# EasyEDA schematic SCH_OnBoard_2023-06-21.json
TITLE: Sheet_1; REV: 1.0; Date: 2023-06-21; Sheet: 1/1; Drawn By: Yutaro Urata2; Company: Your Company
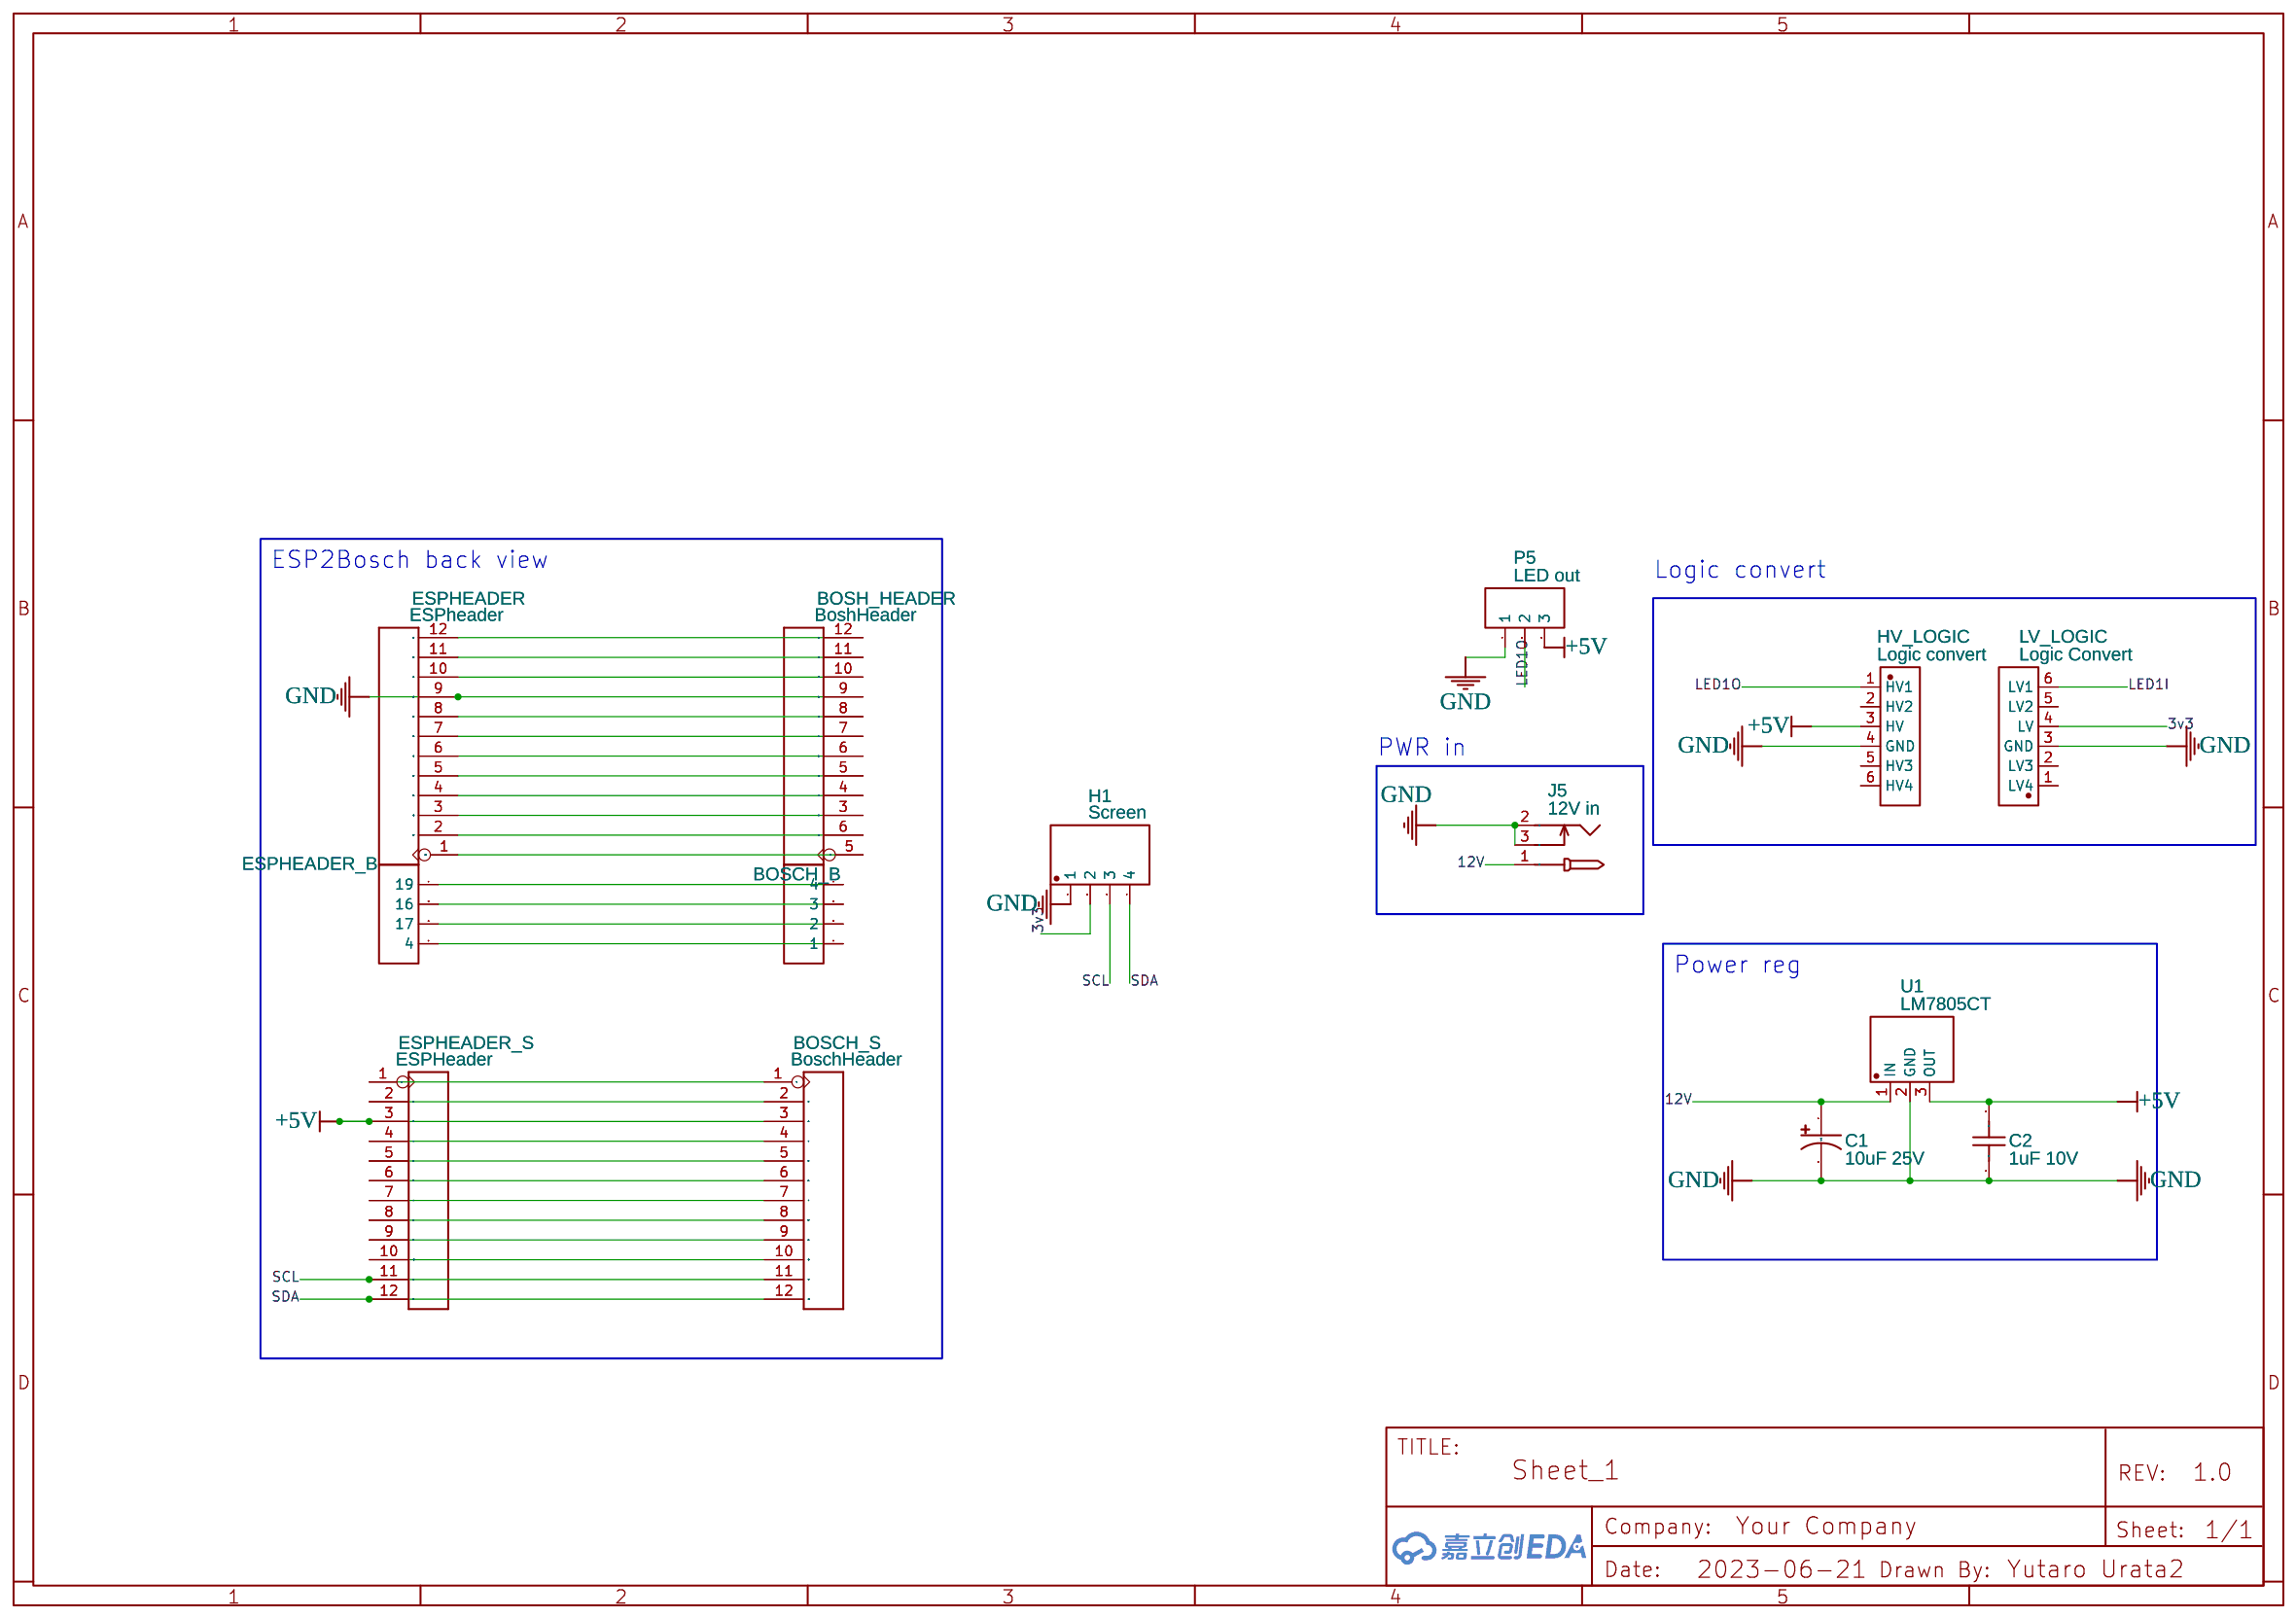
[diagram p0: schematic sheet]

## Parts
BOSCH_B  Header-Female-2.54_1x4  [HDR-4X1/2.54]
BOSCH_S  BoschHeader  [H12-2.54]
BOSH_HEADER  BoshHeader  [H12-2.54]
C1  10uF 25V  [CAP-SMD_L3.5-W2.8-R-RD]
C2  1uF 10V  [C0402]
ESPHEADER  ESPheader  [H12-2.54]
ESPHEADER_B  Header-Female-2.54_1x4  [HDR-4X1/2.54]
ESPHEADER_S  ESPHeader  [H12-2.54]
H1  Screen  [HDR-TH_4P-P2.54-V-M]
HV_LOGIC  Logic convert  [HDR-TH_6P-P2.54-V-F]
J5  12V in  [DC-IN-TH_DC-005C-20A]
LV_LOGIC  Logic Convert  [HDR-TH_6P-P2.54-V-F]
P5  LED out  [HDR-TH_3P-P2.54-V-F]
U1  LM7805CT  [TO-220-3_L10.0-W4.5-P2.54-L]

## Library data of the parts
BOSCH_B ESPHEADER_B = Header-Female-2.54_1x4: Supplier: LCSC; Manufacturer: ReliaPro; Supplier Part: C124413
BOSCH_S BOSH_HEADER ESPHEADER ESPHEADER_S = HEADER-12P-2.54
C1 = CA45A-B-25V-10UF-K: Supplier: LCSC; Supplier Part: C161582; Manufacturer: CEC(振华新云); Manufacturer Part: CA45A-B-25V-10uF-K; Contributor: LCSC; JLCPCB Part Class: Extended Part
C2 = GRM155R61A105KE01D: Supplier: LCSC; Manufacturer: null; Supplier Part: C76998; JLCPCB Part Class: Extended Part
H1 = Header-Male-2.54_1x4: Supplier: LCSC; Manufacturer: Ckmtw(灿科盟); Manufacturer Part: B-2100S04P-A110; Contributor: LCSC; Supplier Part: C124378; JLCPCB Part Class: Extended Part
HV_LOGIC LV_LOGIC = Header-Female-2.54_1x6: Supplier: LCSC; Manufacturer: BOOMELE(博穆精密); Manufacturer Part: 2.54-1*6P母; Supplier Part: C40877; JLCPCB Part Class: Extended Part
J5 = DC-005C-20A: Supplier: LCSC; Manufacturer: 韩国韩荣; Supplier Part: C84007; JLCPCB Part Class: Extended Part
P5 = Header-Female-2.54_1x3: Supplier Part: C146243; Supplier: LCSC; Manufacturer: BOOMELE(博穆精密); Manufacturer Part: 2.54-1*3P母; link: https://datasheet.lcsc.com/szlcsc/Boom-Precision-Elec-2-54mm-1-8P-Straight-Female-header_C27438.pdf; JLCPCB Part Class: Extended Part
U1 = LM7805CT: Supplier: LCSC; Manufacturer: onsemi(安森美); Supplier Part: C22146; JLCPCB Part Class: Extended Part

## Nets
3v3: H1.2 LV_LOGIC.4(LV)
12V: C1.1 J5.1 U1.1(IN)
+5V: BOSCH_S.3 C2.2 ESPHEADER_S.3 HV_LOGIC.3(HV) P5.3 U1.3(OUT)
GND: BOSH_HEADER.9 C1.2 C2.1 ESPHEADER.9(GND) H1.1 HV_LOGIC.4(GND) J5.2 J5.3 LV_LOGIC.3(GND) P5.1 U1.2(GND)
LED1I: LV_LOGIC.6(LV1)
LED1O: HV_LOGIC.1(HV1) P5.2
SCL: BOSCH_S.11 ESPHEADER_S.11 H1.3
SDA: BOSCH_S.12 ESPHEADER_S.12 H1.4
Net-(BOSCH_B-1): BOSCH_B.1 ESPHEADER_B.1(4)
Net-(BOSCH_B-2): BOSCH_B.2 ESPHEADER_B.2(17)
Net-(BOSCH_B-3): BOSCH_B.3 ESPHEADER_B.3(16)
Net-(BOSCH_B-4): BOSCH_B.4 ESPHEADER_B.4(19)
Net-(BOSCH_S-1): BOSCH_S.1 ESPHEADER_S.1
Net-(BOSCH_S-2): BOSCH_S.2 ESPHEADER_S.2
Net-(BOSCH_S-4): BOSCH_S.4 ESPHEADER_S.4
Net-(BOSCH_S-5): BOSCH_S.5 ESPHEADER_S.5
Net-(BOSCH_S-6): BOSCH_S.6 ESPHEADER_S.6
Net-(BOSCH_S-7): BOSCH_S.7 ESPHEADER_S.7
Net-(BOSCH_S-8): BOSCH_S.8 ESPHEADER_S.8
Net-(BOSCH_S-9): BOSCH_S.9 ESPHEADER_S.9
Net-(BOSCH_S-10): BOSCH_S.10 ESPHEADER_S.10(VUSB)
Net-(BOSH_HEADER-3): BOSH_HEADER.3 ESPHEADER.3(35)
Net-(BOSH_HEADER-4): BOSH_HEADER.4 ESPHEADER.4(36)
Net-(BOSH_HEADER-5): BOSH_HEADER.5 ESPHEADER.1(23) ESPHEADER.5(39)
Net-(BOSH_HEADER-6): BOSH_HEADER.6 ESPHEADER.2(18) ESPHEADER.6(34)
Net-(BOSH_HEADER-7): BOSH_HEADER.7 ESPHEADER.7(25)
Net-(BOSH_HEADER-8): BOSH_HEADER.8 ESPHEADER.8(26)
Net-(BOSH_HEADER-10): BOSH_HEADER.10 ESPHEADER.10(NC)
Net-(BOSH_HEADER-11): BOSH_HEADER.11 ESPHEADER.11(3v3)
Net-(BOSH_HEADER-12): BOSH_HEADER.12 ESPHEADER.12(RST)

Not connected (* = marked no-connect by the designer): HV_LOGIC 2(HV2) 5(HV3) 6(HV4); LV_LOGIC 1(LV4) 2(LV3) 5(LV2)

## Notes on the sheet
- ESP2Bosch back view
- Logic convert
- PWR in
- Power reg
